# Altium project KS2E-PRECHG.PrjPcb
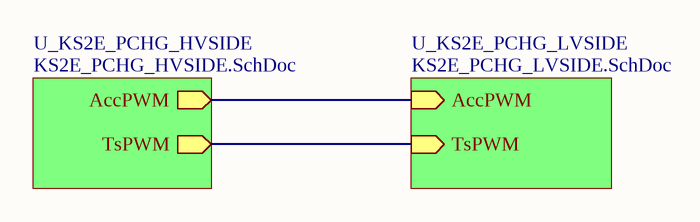
[diagram p0: KS2E_PRECHARGE.SchDoc]
3 sheets, 92 parts. Net scope: hierarchical (ports join the sheet entries above them; power ports are global).
Board file: KS2E_PRECHARGE.PcbDoc
Sheets:
  KS2E_PRECHARGE.SchDoc
    U_KS2E_PCHG_HVSIDE = KS2E_PCHG_HVSIDE.SchDoc
    U_KS2E_PCHG_LVSIDE = KS2E_PCHG_LVSIDE.SchDoc

## Sheet KS2E_PRECHARGE.SchDoc
size A; SheetNumber: 1; SheetTotal: 3

### Sub-sheets
U_KS2E_PCHG_HVSIDE = KS2E_PCHG_HVSIDE.SchDoc: TsPWM (out), AccPWM (out)
U_KS2E_PCHG_LVSIDE = KS2E_PCHG_LVSIDE.SchDoc: AccPWM (in), TsPWM (in)

### Nets
AccPWM: sheet U_KS2E_PCHG_HVSIDE/AccPWM, sheet U_KS2E_PCHG_LVSIDE/AccPWM
TsPWM: sheet U_KS2E_PCHG_HVSIDE/TsPWM, sheet U_KS2E_PCHG_LVSIDE/TsPWM

## Sheet KS2E_PCHG_HVSIDE.SchDoc
size A; SheetNumber: 3; SheetTotal: 3
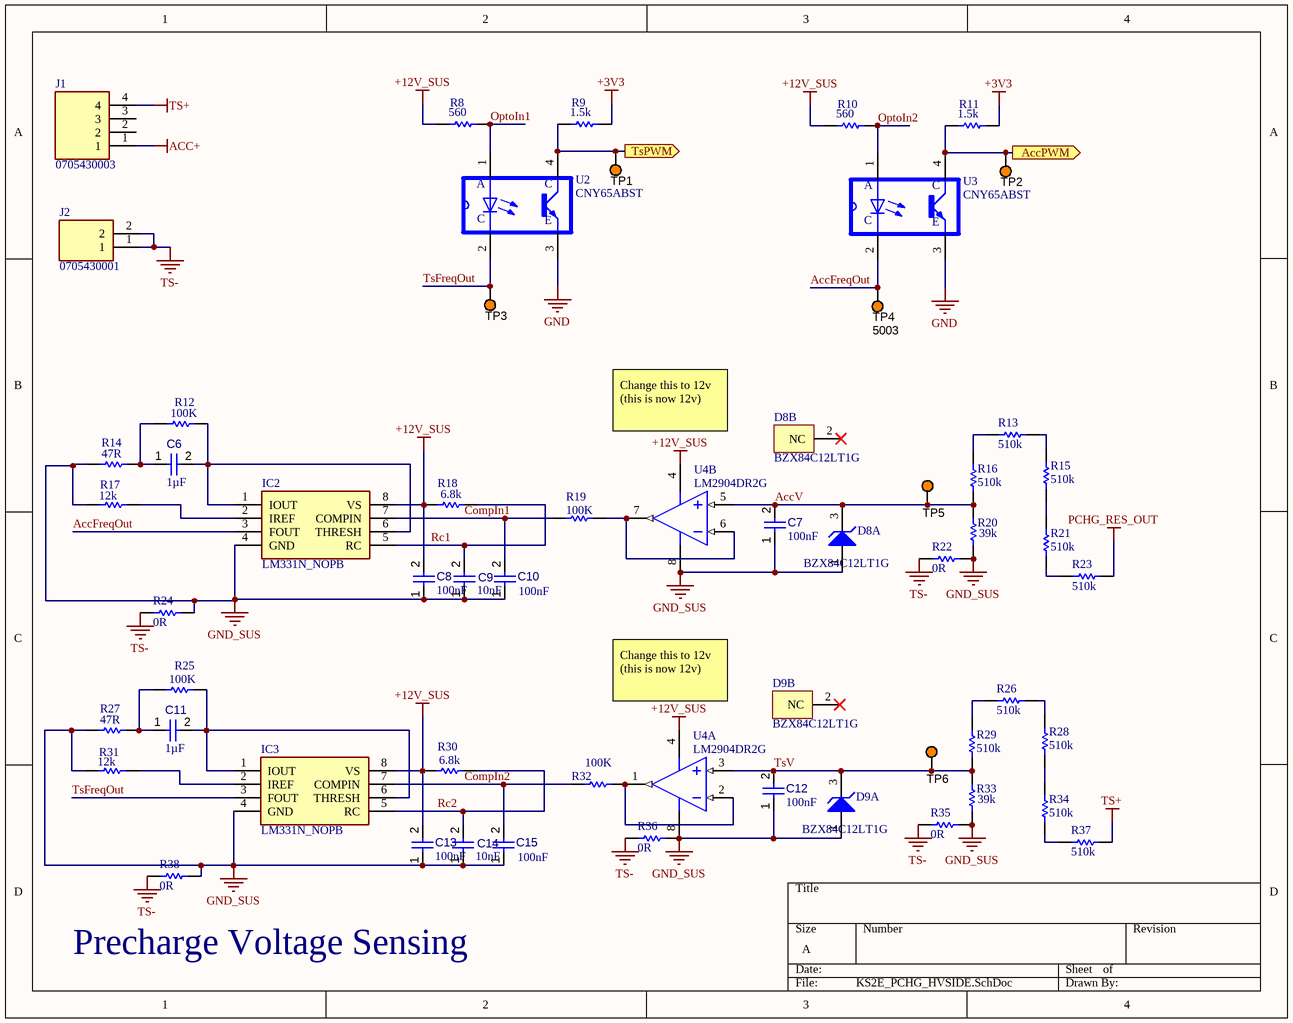
[diagram p1: KS2E_PCHG_HVSIDE.SchDoc]

### Parts
C6  value 1µF  [CAPC0603(1608)100_L]  (hidden comment: Capacitor 1µF +/-0.1% 25V 0603)
C7  value 100nF  [CAPC1608X90X40NL10T20]  (hidden comment: Capacitor 100 nF +/-10% 50 V 0603)
C8  value 100nF  [CAPC1608X90X40NL10T20]  (hidden comment: Capacitor 100 nF +/-10% 50 V 0603)
C9  value 10nF  [CAPC1608X90X40NL10T20]  (hidden comment: Capacitor 100 nF +/-10% 50 V 0603)
C10  value 100nF  [CAPC1608X90X40NL10T20]  (hidden comment: Capacitor 100 nF +/-10% 50 V 0603)
C11  value 1µF  [CAPC0603(1608)100_L]  (hidden comment: Capacitor 1µF +/-0.1% 25V 0603)
C12  value 100nF  [CAPC1608X90X40NL10T20]  (hidden comment: Capacitor 100 nF +/-10% 50 V 0603)
C13  value 100nF  [CAPC1608X90X40NL10T20]  (hidden comment: Capacitor 100 nF +/-10% 50 V 0603)
C14  value 10nF  [CAPC1608X90X40NL10T20]  (hidden comment: Capacitor 100 nF +/-10% 50 V 0603)
C15  value 100nF  [CAPC1608X90X40NL10T20]  (hidden comment: Capacitor 100 nF +/-10% 50 V 0603)
D8  BZX84C12LT1G  [ONSC-SOT-23-3-318-08_V]  (parts A,B of 2)
D9  BZX84C12LT1G  [ONSC-SOT-23-3-318-08_V]  (parts A,B of 2)
IC2  LM331N_NOPB  [DIP794W53P254L959H508Q8N]
IC3  LM331N_NOPB  [DIP794W53P254L959H508Q8N]
J1  0705430003  [SHDR4W64P0X254_1X4_1271X660X1181P]
J2  0705430001  [SHDR2W64P0X254_1X2_737X660X1181P]
R8  Resistance: 560  [RESC1609X55X30LL15T15]  (hidden comment: ERJ3EKF1002V)
R9  Resistance: 1.5k  [RESC1609X55X30LL15T15]  (hidden comment: ERJ3EKF1002V)
R10  Resistance: 560  [RESC1609X55X30LL15T15]  (hidden comment: ERJ3EKF1002V)
R11  Resistance: 1.5k  [RESC1609X55X30LL15T15]  (hidden comment: ERJ3EKF1002V)
R12  Resistance: 100K  [RESC1609X55X30LL15T15]  (hidden comment: ERJ3EKF1002V)
R13  510k  [RESC2013X60X40NL20T25]
R14  Resistance: 47R  [RESC1609X55X30LL15T15]  (hidden comment: ERJ3EKF1002V)
R15  510k  [RESC2013X60X40NL20T25]
R16  510k  [RESC2013X60X40NL20T25]
R17  Resistance: 12k  [RESC1609X55X30LL15T15]  (hidden comment: ERJ3EKF1002V)
R18  Resistance: 6.8k  [RESC1609X55X30LL15T15]  (hidden comment: ERJ3EKF1002V)
R19  Resistance: 100K  [RESC1609X55X30LL15T15]  (hidden comment: ERJ3EKF1002V)
R20  39k  [RESC2013X60X40LL20T25]
R21  510k  [RESC2013X60X40NL20T25]
R22  0R  [RESC2013X65X40LL15T20]
R23  510k  [RESC2013X60X40NL20T25]
R24  0R  [RESC2013X65X40LL15T20]
R25  Resistance: 100K  [RESC1609X55X30LL15T15]  (hidden comment: ERJ3EKF1002V)
R26  510k  [RESC2013X60X40NL20T25]
R27  Resistance: 47R  [RESC1609X55X30LL15T15]  (hidden comment: ERJ3EKF1002V)
R28  510k  [RESC2013X60X40NL20T25]
R29  510k  [RESC2013X60X40NL20T25]
R30  Resistance: 6.8k  [RESC1609X55X30LL15T15]  (hidden comment: ERJ3EKF1002V)
R31  Resistance: 12k  [RESC1609X55X30LL15T15]  (hidden comment: ERJ3EKF1002V)
R32  Resistance: 100K  [RESC1609X55X30LL15T15]  (hidden comment: ERJ3EKF1002V)
R33  value 39k  [RESC2013X60X40LL20T25]  (hidden comment: ERA6AEB393V)
R34  510k  [RESC2013X60X40NL20T25]
R35  0R  [RESC2013X65X40LL15T20]
R36  0R  [RESC2013X65X40LL15T20]
R37  510k  [RESC2013X60X40NL20T25]
R38  0R  [RESC2013X65X40LL15T20]
TP1  5003  [KSTN-5003]  (value not drawn)
TP2  5003  [KSTN-5003]  (value not drawn)
TP3  5003  [KSTN-5003]  (value not drawn)
TP4  5003  [KSTN-5003]
TP5  5003  [KSTN-5003]  (value not drawn)
TP6  5003  [KSTN-5003]  (value not drawn)
U2  CNY65ABST  [SOIC762P1940X755-4N]
U3  CNY65ABST  [SOIC762P1940X755-4N]
U4  LM2904DR2G  [ONSC-SOIC-8-751-07_V]  (parts A,B of 2)

### Ports
AccPWM (out), TsPWM (out)

### Nets
+3V3: R9.1 R11.1
+12V_SUS: C8.2 C13.2 IC2.8(VS) IC3.8(VS) R8.1 R10.1 R18.1 R30.1 U4.4(VEE/GND)
ACC+: J1.1
GND: U2.3(E) U3.3(E)
GND_SUS: C7.1 C8.1 C9.1 C10.1 C12.1 C13.1 C14.1 C15.1 D8.1(A) D9.1(A) IC2.4(GND) IC3.4(GND) R14.1 R17.1 R20.1 R22.1 R24.1 R27.1 R31.1 R33.1 R35.1 R36.1 R38.1 U4.8(VCC)
PCHG_RES_OUT: R23.2
TS+: J1.4 R37.2
TS-: J2.1 J2.2 R22.2 R24.2 R35.2 R36.2 R38.2
AccFreqOut: IC2.3(FOUT) TP4.1 U3.2(C)
AccPWM: R11.2 TP2.1 U3.4(C`) ; port AccPWM
AccV: C7.2 D8.3(K) R16.2 R20.2 TP5.1 U4.5(INB+)
CompIn1: C10.2 IC2.7(COMPIN) R19.1
CompIn2: C15.2 IC3.7(COMPIN) R32.1
OptoIn1: R8.2 U2.1(A)
OptoIn2: R10.2 U3.1(A)
Rc1: C9.2 IC2.5(RC) R18.2
Rc2: C14.2 IC3.5(RC) R30.2
TsFreqOut: IC3.3(FOUT) TP3.1 U2.2(C)
TsPWM: R9.2 TP1.1 U2.4(C`) ; port TsPWM
TsV: C12.2 D9.3(K) R29.2 R33.2 TP6.1 U4.3(INA+)
NetC6_1: C6.1 R12.1 R14.2
NetC6_2: C6.2 IC2.1(IOUT) IC2.6(THRESH) R12.2
NetC11_1: C11.1 R25.1 R27.2
NetC11_2: C11.2 IC3.1(IOUT) IC3.6(THRESH) R25.2
NetIC2_2: IC2.2(IREF) R17.2
NetIC3_2: IC3.2(IREF) R31.2
NetR13_1: R13.1 R15.2
NetR13_2: R13.2 R16.1
NetR15_1: R15.1 R21.1
NetR19_2: R19.2 U4.6(INB-) U4.7(OUTB)
NetR21_2: R21.2 R23.1
NetR26_1: R26.1 R28.2
NetR26_2: R26.2 R29.1
NetR28_1: R28.1 R34.1
NetR32_2: R32.2 U4.1(OUTA) U4.2(INA-)
NetR34_2: R34.2 R37.1

Not connected (* = marked no-connect by the designer): D8 2(NC)*; D9 2(NC)*; J1 2 3

### Notes on the sheet
- Change this to 12v
  (this is now 12v)
- Precharge Voltage Sensing

### Library data of the parts
C6 C11 = CMP-001-00055-4: Chip Capacitor, 1µF +/-0.1%, 25V, 0603, Thickness 1 mm; Tolerance: 20%; Min Operating Temperature: -55°C; Max Operating Temperature: 85°C; Voltage Rating: 25V; Mounting Technology: SMT; Case/Package: 0603; Pins: 2
C7-C10 C12-C15 = CMP-001-00017-6: Chip Capacitor, 100 nF, +/- 10%, 50 V, 0603 (1608 Metric); Voltage Rating: 50V; Capacitor Type: Ceramic; Tolerance: 10%; Mounting Technology: SM; Max Operating Temperature: 125°C; RoHS Compliant: True; Pins: 2; Case/Package: 0603; Min Operating Temperature: -55°C
D8 D9 = CMP-1060-00857-1: Zener Voltage Regulator, 225 mW, 3-Pin SOT-23, Pb-Free, Tape and Reel; Manufacturer: On Semiconductor; PackageDescription: 3-Pin Small Outline Transistor, Body 2.92 x 1.3 mm, Pitch 0.95 mm; ComponentLink1URL: http://www.onsemi.com/; ComponentLink3URL: http://www.onsemi.cn/pub_link/Collateral/318-08.PDF; Mounting Technology: Surface Mount; PartNumber: BZX84C12LT1G; ComponentLink3Description: Package Specification; RoHS: Pb-Free; DatasheetVersion: Rev. 17; ComponentLink2URL: http://www.onsemi.com/pub_link/Collateral/BZX84C2V4LT1-D.PDF; ComponentLink2Description: Datasheet; ComponentLink1Description: Manufacturer URL; Packing: Tape and Reel; PackageReference: SOT-23-3-318-08; PackageVersion: Rev. AP, 11/2009
IC2 IC3 = LM331N_NOPB: Integrated Circuit; Manufacturer_Name: Texas Instruments; Manufacturer_Part_Number: LM331N/NOPB; Datasheet Link: http://www.ti.com/lit/ds/symlink/lm231.pdf; Height: 5.08mm; Mouser Part Number: 926-LM331N/NOPB; Mouser Price/Stock: https://www.mouser.co.uk/ProductDetail/Texas-Instruments/LM331N-NOPB?qs=X1J7HmVL2ZHJklHIKp8KMQ%3D%3D; Arrow Part Number: LM331N/NOPB; Arrow Price/Stock: https://www.arrow.com/en/products/lm331nnopb/texas-instruments?region=nac
J1 = 0705430003: Connector; Manufacturer_Name: Molex; Datasheet Link: https://www.molex.com/pdm_docs/sd/705430001_sd.pdf; Height: 11.81mm; Manufacturer_Part_Number: 0705430003; Mouser Part Number: N/A; Mouser Price/Stock: https://www.mouser.co.uk/ProductDetail/Molex/0705430003?qs=PBcRNPEHKsrDKEIJAwSKnQ%3D%3D; Arrow Part Number: 0705430003; Arrow Price/Stock: https://www.arrow.com/en/products/0705430003/molex
J2 = 0705430001: Connector; Manufacturer_Name: Molex; Datasheet Link: https://www.molex.com/webdocs/datasheets/pdf/en-us/0705430001_PCB_HEADERS.pdf; Height: 11.81mm; Manufacturer_Part_Number: 0705430001; Mouser Part Number: N/A; Mouser Price/Stock: https://www.mouser.co.uk/ProductDetail/Molex/0705430001?qs=PBcRNPEHKsrZYrVlaLTOSA%3D%3D; Arrow Part Number: 0705430001; Arrow Price/Stock: https://www.arrow.com/en/products/0705430001/molex?region=europe
R8-R12 R14 R17-R19 R25 R27 R30-R32 = CMP-1012-00623-3: Chip Resistor, 10 KOhm, +/- 1%, 0.1 W, -55 to 155 degC, 0603 (1608 Metric), RoHS, Tape and Reel; Manufacturer: Panasonic; Voltage Rating: 75V; Case\/Package: 0603; Power Rating: 100mW; Temperature Coefficient: 100ppm\/degreesC; Number of Pins: 2; Package Reference: 603; Depth: 0.8mm; Mount: SurfaceMount; Package Description: 2-Pin Surface Mount Device, Body 1.6 x 0.85 mm; Datasheet Version: 02/2017; Length: 1.6mm; Lead Free: LeadFree; Height: 0.45mm; Number of Terminations: 2; Max Power Dissipation: 100mW; Min Operating Temperature: -55degC; Datasheet URL: https://industrial.panasonic.com/cdbs/www-data/pdf/RDA0000/AOA0000C304.pdf; Termination: SMD/SMT; Case Code (Metric): 1608; Case Code (Imperial): 0603; Tolerance: 1%; Max Operating Temperature: 155degC; RoHSCompliant: true; Voltage Rating (DC): 75V; Radiation Hardening: No; Packaging: TapeandReel; Composition: ThickFilm; Mounting Technology: SurfaceMount; Manufacturer URL: http://www.panasonic.com/; Width: 0.031inch; REACH SVHC: NoSVHC; Contact Plating: Tin; Military Standard: Not; Package Quantity: 1
R13 R15 R16 R21 R23 R26 R28 R29 R34 R37 = CMP-2001-00651-1: Part Number: ERA-6AEB514V; Manufacturer: Panasonic
R20 = CMP-2001-00636-1: Manufacturer: Panasonic; Part Number: ERA6AEB393V; Value: 39k
R22 R24 R35 R36 R38 = CMP-2000-07514-1: Chip Resistor, 0 Ohm, 0.125 W, -55 to 125 degC, 0805 (2012 Metric), RoHS, Tape and Reel; Manufacturer: TE Connectivity; Power Rating: 125mW; Voltage Rating: 150V; Tolerance: 0%; Case\/Package: 0805; Number of Resistors: 1; Resistance: 0mOhm; Datasheet URL: www.te.com/commerce/DocumentDelivery/DDEController?Action=showdoc&DocId=Customer+Drawing%7F1623401%7FBA%7Fpdf%7FEnglish%7FENG_CD_1623401_BA.pdf%7F1623401-1; Composition: ThickFilm; Max Operating Temperature: 125degC; Min Operating Temperature: -55degC; ELV: Compliant; Case Code (Metric): 2012; Number of Terminations: 2; Weight: 0.000194oz; Length: 2mm; Mount: SurfaceMount; Packaging: TapeandReel; Case Code (Imperial): 0805; RoHSCompliant: true; Width: 1.25mm; Radiation Hardening: No; Termination: Solder; Manufacturer URL: http://www.te.com/; Package Description: 2-Pin Surface Mount Device, Body 2 x 1.25 mm; Mounting Technology: SurfaceMount; Height: 0.55mm; Package Quantity: 5000; Package Reference: RESC2013X65X40L15T20; Datasheet Version: Rev. BA, 12/2009; Depth: 1.25mm
R33 = CMP-2001-00636-1: Manufacturer: Panasonic; Part Number: ERA6AEB393V
TP1-TP6 = CMP-002-00037-2: Test Point, Orange, Height 4.6 mm, Tail Length 3 mm, 1-Pin THD, RoHS; Manufacturer: Keystone; Colour: Orange; Packaging: Bulk; Package Description: 1-Pin Through Hole Device, Dia 2.54 mm; Pins: 1; Package Reference: 5003; Datasheet Version: Jun-15; Case/Package: 5003; Mounting Technology: TH; Connector Type: TestPoint; Diameter: 2.54mm; Contact Material: Bronze; Datasheet URL: http://keyelco.com/userAssets/file/M65p56.pdf; Manufacturer URL: http://www.keyelco.com/; Package Quantity: 10; Contact Plating: Tin; RoHS Compliant: True
U2 U3 = CNY65ABST: Semiconductor, Optocoupler; 600 mil High Voltage Isolation Dist; CTR, 80-240%; SMD-4; MF: Vishay Semiconductor; Value: *; MP: CNY65ABST; SnapEDA_Link: https://www.snapeda.com/parts/CNY65ABST/Vishay%20Semiconductor%20Opto%20Division/view-part/461465/?ref=snap; Availability: Unavailable; Package: SMD-4 Vishay; Price: None
U4 = CMP-1310-00321-1: Single Supply Dual Operational Amplifier, 3 to 32 V, -40 to 105 degC, 8-Pin SOIC, Pb-Free, Tape and Reel; Manufacturer: On Semiconductor; VCC Min (V): 3; VCC Max (V): 32; PackageDescription: 8-Pin Small Outline Integrated Circuit, Body 4.9 x 3.9 mm, Pitch 1.27 mm; RoHS: TRUE; ComponentLink1URL: http://www.onsemi.com/; Mounting Technology: Surface Mount; PackageReference: SOIC-8-751-07; Packing: Tape and Reel; DatasheetVersion: Rev. 27; PartNumber: LM2904DR2G; PackageVersion: Rev. AK, 02/2011; ComponentLink1Description: Manufacturer URL; ComponentLink3URL: http://www.onsemi.com/pub_link/Collateral/751-07.PDF; ComponentLink2Description: Datasheet; ComponentLink3Description: Package Specification; ComponentLink2URL: http://www.onsemi.cn/pub_link/Collateral/LM358-D.PDF

## Sheet KS2E_PCHG_LVSIDE.SchDoc
size A; SheetNumber: 2; SheetTotal: 3
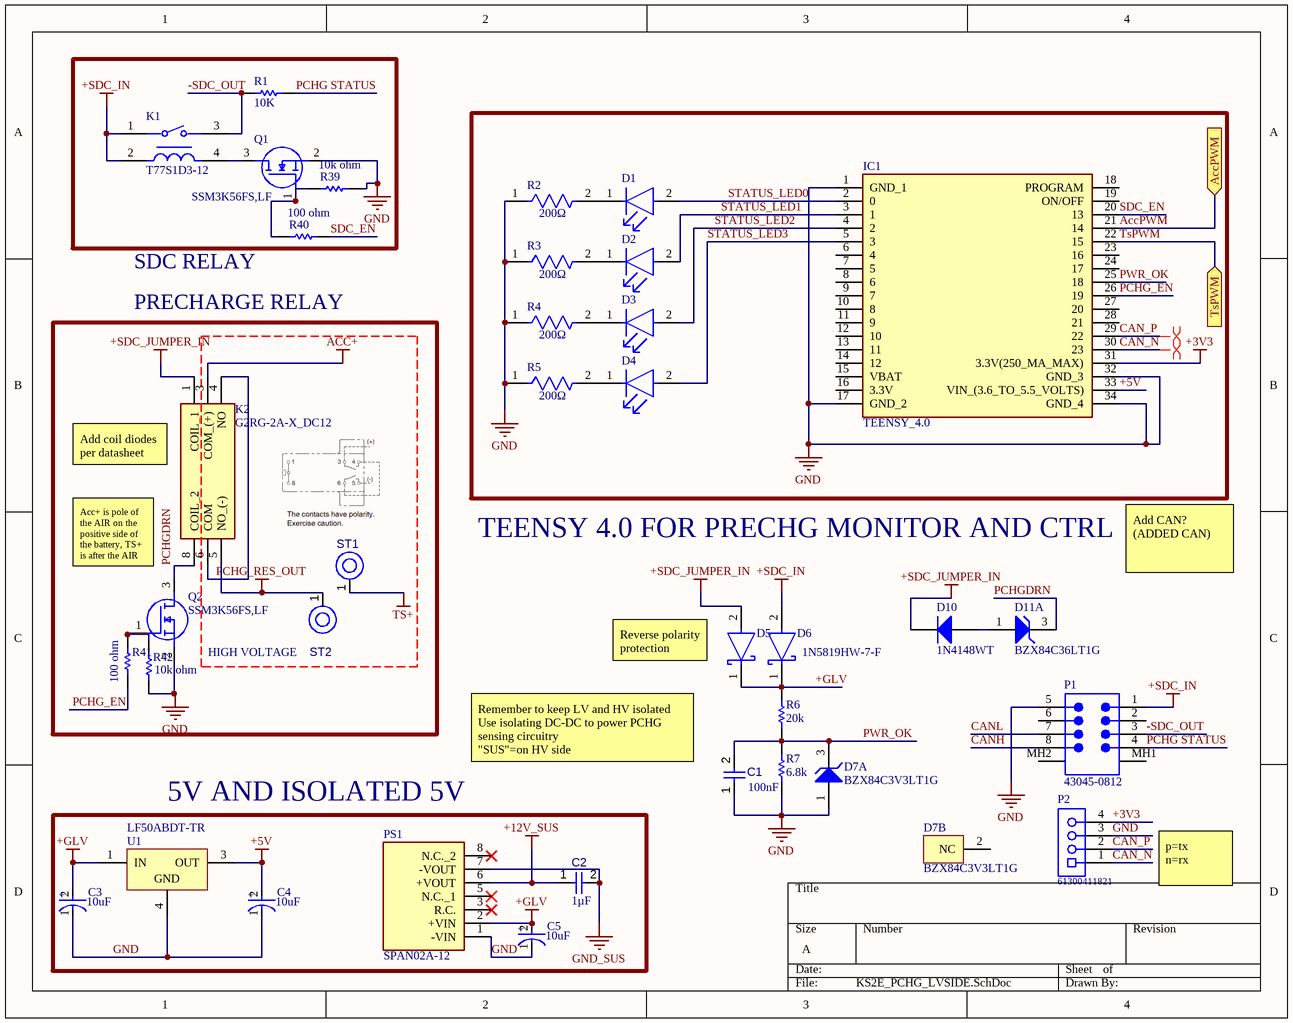
[diagram p2: KS2E_PCHG_LVSIDE.SchDoc]

### Parts
C1  value 100nF  [CAPC1608X90X40NL10T20]  (hidden comment: Capacitor 100 nF +/-10% 50 V 0603)
C2  value 1µF  [CAPC0603(1608)100_L]  (hidden comment: Capacitor 1µF +/-0.1% 25V 0603)
C3  Capacitance: 10uF  [FP-FKB-MFG]  (hidden comment: EEEFK1E100R)
C4  Capacitance: 10uF  [FP-FKB-MFG]  (hidden comment: EEEFK1E100R)
C5  Capacitance: 10uF  [FP-FKB-MFG]  (hidden comment: EEEFK1E100R)
D1  LTST-C193KGKT-5A  [FP-LTST-C193KGKT-5A-MFG]  (value not drawn)
D2  LTST-C193KRKT-5A  [FP-LTST-C193KRKT-5A-MFG]  (value not drawn)
D3  LTST-C193KGKT-5A  [FP-LTST-C193KGKT-5A-MFG]  (value not drawn)
D4  LTST-C193KRKT-5A  [FP-LTST-C193KRKT-5A-MFG]  (value not drawn)
D5  1N5819HW-7-F  [FP-SOD123-IPC_A]
D6  1N5819HW-7-F  [FP-SOD123-IPC_A]  (value not drawn)
D7  BZX84C3V3LT1G  [ONSC-SOT-23-3-318-08_V]  (parts A,B of 2)
D10  1N4148WT  [FAIR-SOD-523F-2_V]
D11  BZX84C36LT1G  [ONSC-SOT-23-3-318-08_V]  (part A of 2)
IC1  TEENSY_4.0  [TEENSY40]
K1  T77S1D3-12  [FP-T77S1D3-12-MFG]
K2  G2RG-2A-X_DC12  [G2RG2AXDC12]
P1  43045-0812  [MOLX-43045-0812_V]
P2  61300411821  [61300411821]
PS1  SPAN02A-12  [SPAN02A12]
Q1  SSM3K56FS,LF  [1SS423]
Q2  SSM3K56FS,LF  [1SS423]
R1  10K  [RESC1608X55X30ML15T15]
R2  Resistance: 200Ω  [FP-RN732A-MFG]  (hidden comment: RN73C2A200RBTD)
R3  Resistance: 200Ω  [FP-RN732A-MFG]  (hidden comment: RN73C2A200RBTD)
R4  Resistance: 200Ω  [FP-RN732A-MFG]  (hidden comment: RN73C2A200RBTD)
R5  Resistance: 200Ω  [FP-RN732A-MFG]  (hidden comment: RN73C2A200RBTD)
R6  20k  [RESC1608X55X30ML15T15]
R7  6.8k  [RESC1608X55X30ML15T15]
R39  10k ohm  [RESC1608X55X30LL15T15]
R40  100 ohm  [RESC1608X55X30LL15T15]
R41  100 ohm  [RESC1608X55X30LL15T15]
R42  10k ohm  [RESC1608X55X30LL15T15]
ST1  PTH-M2D5X5  [PTH-M2D5X5]  (value not drawn)
ST2  PTH-M2D5X5  [PTH-M2D5X5]  (value not drawn)
U1  LF50ABDT-TR  [TO-252_M]

### Blocks framed on the sheet
PRECHARGE RELAY: K2 Q2 R41 R42 ST1 ST2
5V AND ISOLATED 5V: C2-C5 PS1 U1

### Ports
AccPWM (in), TsPWM (in)

### Nets
+3V3: IC1.31(3.3V(250_MA_MAX)) P2.4
+5V: C4.2(A) IC1.33(VIN_(3.6_TO_5.5_VOLTS)) U1.3(OUT)
+12V_SUS: C2.1 PS1.6(+VOUT)
+GLV: C3.2(A) C5.2(A) D5.1(C) D6.1(C) PS1.2(+VIN) R6.2 U1.1(IN)
+SDC_IN: D6.2(A) K1.1 K1.2 P1.1
+SDC_JUMPER_IN: D5.2(A) D10.1(K) K2.1(COIL_1)
ACC+: K2.3(COM_(+))
GND: C1.1 C3.1(C) C4.1(C) C5.1(C) D7.1(A) IC1.1(GND_1) IC1.17(GND_2) IC1.32(GND_3) IC1.34(GND_4) P1.5 P2.3 PS1.1(-VIN) Q1.2(S) Q2.2(S) R2.1 R3.1 R4.1 R5.1 R7.1 R39.2 R42.2 U1.4(GND)
GND_SUS: C2.2 PS1.7(-VOUT)
PCHG_RES_OUT: K2.5(NO_(-)) ST2.1(H1)
TS+: ST1.1(H1)
-SDC_OUT: K1.3 P1.3 R1.2
AccPWM: IC1.21(14) ; port AccPWM
CAN_N: IC1.30(23) P2.1
CAN_P: IC1.29(22) P2.2
CANH: P1.8
CANL: P1.7
PCHG STATUS: P1.4 R1.1
PCHG_EN: IC1.26(19) R41.1
PCHGDRN: D11.3(K) K2.8(COIL_2) Q2.3(D)
PWR_OK: C1.2 D7.3(K) IC1.25(18) R6.1 R7.2
SDC_EN: IC1.20(13) R40.2
STATUS_LED0: D1.2(A) IC1.2(0)
STATUS_LED1: D2.2(A) IC1.3(1)
STATUS_LED2: D3.2(A) IC1.4(2)
STATUS_LED3: D4.2(A) IC1.5(3)
TsPWM: IC1.22(15) ; port TsPWM
NetD1_1: D1.1(C) R2.2
NetD2_1: D2.1(C) R3.2
NetD3_1: D3.1(C) R4.2
NetD4_1: D4.1(C) R5.2
NetD10_2: D10.2(A) D11.1(A)
NetK1_4: K1.4 Q1.3(D)
NetK2_4: K2.4(NO) K2.6(COM)
NetQ1_1: Q1.1(G) R39.1 R40.1
NetQ2_1: Q2.1(G) R41.2 R42.1

Not connected (* = marked no-connect by the designer): D7 2(NC); IC1 6(4) 7(5) 8(6) 9(7) 10(8) 11(9) 12(10) 13(11) 14(12) 15(VBAT) 16(3.3V) 18(PROGRAM) 19(ON/OFF) 23(16) 24(17) 27(20) 28(21); P1 2 6 MH1 MH2; PS1 3(R.C.)* 5(N.C._1)* 8(N.C._2)*

### Layout directives
differential pair: CAN_N, CAN_P

### Notes on the sheet
- SDC RELAY
- (near K2) Add coil diodes
  per datasheet
- Acc+ is pole of the AIR on the positive side of the battery, TS+ is after the AIR
- TEENSY 4.0 FOR PRECHG MONITOR AND CTRL
- Add CAN?
  (ADDED CAN)
- (near Q2) HIGH VOLTAGE
- (near D5) Reverse polarity protection
- Remember to keep LV and HV isolated
  Use isolating DC-DC to power PCHG sensing circuitry
  "SUS"=on HV side
- p=tx
  n=rx
- (in symbol CMP-05427-000055-1) +

### Library data of the parts
C1 = CMP-001-00017-6: as C7 on sheet KS2E_PCHG_HVSIDE; Tolerance: 10%; Mounting Technology: SM; Max Operating Temperature: 125°C; RoHS Compliant: True; Pins: 2; Case/Package: 0603; Min Operating Temperature: -55°C
C2 = CMP-001-00055-4: as C6 on sheet KS2E_PCHG_HVSIDE; Min Operating Temperature: -55°C; Max Operating Temperature: 85°C; Voltage Rating: 25V; Mounting Technology: SMT; Case/Package: 0603; Pins: 2
C3-C5 = CMP-05427-000055-1: CAP ALUM 10UF 20% 25V SMD; ESR (Equivalent Series Resistance): 1.35R; Life (Hours): 2000Hour; Dielectric Material: Aluminium; Leakage Current: 3uA; Ripple Current (AC): 90mA; Polarity: Polar; Voltage: 25V; Voltage Rating: 25V; Number of Pins: 2; Package Quantity: 1; Max Operating Temperature: 105°C; Tolerance: 20%; Voltage Rating (DC): 25V; Packaging: Tape and Reel; Impedance: 1.35R; Case/Package: Radial; Series: FK; Height - Seated (Max): 0.24inch; Diameter: 4mm; Length: 5.8mm; Construction: Cylindrical; Height: 5.8mm; Mount: Surface Mount; REACH SVHC: No SVHC; Termination: SMD/SMT; Lead Free: Lead Free; RoHS Compliant: Yes; Contact Plating: Tin; Width: 5.5mm; Radiation Hardening: No; Min Operating Temperature: -55°C; Ripple Current: 90mA
D1 D3 = CMP-2000-06622-2: LED GREEN CLEAR CHIP SMD; Forward Current: 30mA; Power Dissipation: 75mW; Luminous Intensity: 28mcd; Lens Style: Diffused; Lens Color: Colorless; Forward Voltage: 2.3V; Test Current: 5mA; Viewing Angle: 130°; Reverse Voltage: 5V; Dominant Wavelength: 576.5nm; Number of Elements: 1; Number of Pins: 2; Case/Package: 0603; Width: 0.8mm; Radiation Hardening: No; Lead Free: Lead Free; Lens Transparency: Clear; Max Operating Temperature: 85°C; Illumination Color: Green; Color: Green; Packaging: Tape and Reel; Depth: 0.8mm; Length: 1.6mm; Mount: Surface Mount; Case Code (Imperial): 0603; Height: 0.35mm; Min Operating Temperature: -55°C; Package Quantity: 3000; Case Code (Metric): 1608; Power Rating: 75mW; Number of LEDs: 1
D2 D4 = CMP-2000-06623-2: LED RED CLEAR CHIP SMD; Power Dissipation: 50mW; Lens Style: Diffused; Test Current: 5mA; Dominant Wavelength: 631nm; Reverse Voltage: 5V; Number of Elements: 1; Viewing Angle: 130°; Luminous Intensity: 45mcd; Lens Color: Colorless; Forward Voltage: 2.3V; Case Code (Imperial): 0603; Illumination Color: Red; Lead Free: Lead Free; Radiation Hardening: No; Width: 0.8mm; Number of Pins: 2; Packaging: Tape and Reel; Depth: 0.8mm; Height: 0.35mm; Mount: Surface Mount; Case Code (Metric): 1608; Forward Current: 5mA; Lens Transparency: Clear; Case/Package: 0603; Length: 1.6mm; Color: Red; Max Operating Temperature: 85°C; Number of LEDs: 1; Min Operating Temperature: -55°C; Package Quantity: 3000
D5 D6 = CMP-0303-00003-3: DIODE SCHOTTKY 40V 1A SOD123; Forward Voltage: 450mV; Capacitance: 110pF; Max Forward Surge Current (Ifsm): 25A; Peak Reverse Current: 50uA; Polarity: Standard; Element Configuration: Single; Max Power Dissipation: 450mW; Min Operating Temperature: -65°C; Package Quantity: 3000; Contact Plating: Tin; Weight: 0.000353oz; Max Repetitive Reverse Voltage (Vrrm): 40V; Max Reverse Voltage (DC): 40V; Height: 1.25mm; Average Rectified Current: 1A; Width: 1.7mm; Case/Package: SOD-123-2; Lead Free: Lead Free; Max Operating Temperature: 125°C; Current Rating: 1A; Termination: SMD/SMT; Forward Current: 1A; Radiation Hardening: No; Number of Pins: 2; Length: 2.85mm; Voltage Rating (DC): 40V; REACH SVHC: No SVHC; Peak Non-Repetitive Surge Current: 25A; Packaging: Tape and Reel; Output Current: 1A
D7 = CMP-1060-01189-1: Zener Voltage Regulator, 225 mW, 3-Pin SOT-23, Pb-Free, Tape and Reel; Manufacturer: On Semiconductor; ComponentLink2Description: Datasheet; ComponentLink3Description: Package Specification; PackageVersion: Rev. AP, 11/2009; ComponentLink3URL: http://www.onsemi.cn/pub_link/Collateral/318-08.PDF; Mounting Technology: Surface Mount; DatasheetVersion: Rev. 17; ComponentLink2URL: http://www.onsemi.com/pub_link/Collateral/BZX84C2V4LT1-D.PDF; PackageDescription: 3-Pin Small Outline Transistor, Body 2.92 x 1.3 mm, Pitch 0.95 mm; RoHS: Pb-Free; ComponentLink1URL: http://www.onsemi.com/; ComponentLink1Description: Manufacturer URL; PartNumber: BZX84C3V3LT1G; PackageReference: SOT-23-3-318-08; Packing: Tape and Reel
D10 = CMP-0881-00001-1: High Conductance Fast Switching Diode, 75 V, -55 to 150 degC, 2-Pin SOD523F, RoHS; Manufacturer: Fairchild Semiconductor; IR (VR: 75 V)=5 uA Max.; VF: 1 V Max.; BVR (IR: 5 uA)=75 V Min.; CO: 4 pF Max.; DatasheetVersion: Rev. A2; ComponentLink1Description: Manufacturer URL; PackageDescription: 2-Pin Surface Mount Device, Body 1.2 x 0.8 mm, Height 0.7 mm; ComponentLink2URL: http://www.fairchildsemi.com/ds/1N/1N4148WT.pdf; ComponentLink2Description: Datasheet; PartNumber: 1N4148WT; ComponentLink1URL: http://www.fairchildsemi.com/; Temperature Range: -55 to 150 degC; Mounting Technology: Surface Mount; PackageReference: SOD-523F-2; RoHS: TRUE
D11 = CMP-1060-01178-1: Zener Voltage Regulator, 225 mW, 3-Pin SOT-23, Pb-Free, Tape and Reel; Manufacturer: On Semiconductor; Packing: Tape and Reel; ComponentLink1Description: Manufacturer URL; Mounting Technology: Surface Mount; ComponentLink3URL: http://www.onsemi.cn/pub_link/Collateral/318-08.PDF; ComponentLink2Description: Datasheet; RoHS: Pb-Free; PartNumber: BZX84C36LT1G; ComponentLink1URL: http://www.onsemi.com/; PackageReference: SOT-23-3-318-08; DatasheetVersion: Rev. 17; PackageDescription: 3-Pin Small Outline Transistor, Body 2.92 x 1.3 mm, Pitch 0.95 mm; ComponentLink2URL: http://www.onsemi.com/pub_link/Collateral/BZX84C2V4LT1-D.PDF; PackageVersion: Rev. AP, 11/2009; ComponentLink3Description: Package Specification
IC1 = TEENSY_4.0: Integrated Circuit; Manufacturer_Name: Teensy; Manufacturer_Part_Number: TEENSY 4.0; Datasheet Link: https://www.pjrc.com/store/teensy40.html; Height: 4.64mm
K1 = CMP-03396-000213-1: RELAY GEN PURPOSE SPST 3A 12V; Coil Power: 200mW; Contact Voltage Rating (DC): 30V; Coil Type: Non-Latching; Voltage Rating (AC): 250V; Coil Current: 16.67mA; Relay Type: General Purpose; Approvals: UL; Coil Resistance: 720R; Release Time: 4ms; Operate Time: 10ms; RoHS Compliant: Yes; Radiation Hardening: No; Height: 14.7mm; Min Operating Temperature: -30°C; Weight: 9g; Contact Current Rating: 3A; Coil Voltage (DC): 12V; Termination: PCB; Series: T77; Depth: 10.2mm; Mount: Through Hole; Current Rating: 3A; Power Consumption: 200mW; Max Voltage Rating (DC): 30V; Number of Pins: 4; Lead Free: Lead Free; Package Quantity: 100; Max Voltage Rating (AC): 250V; Application(s): GENERAL PURPOSE; Power Rating: 200mW; Length: 0.717inch; ELV: Compliant; Width: 0.4inch; Type: Electromechanical; Throw Configuration: SPST; Packaging: Tray; Max Operating Temperature: 105°C; Contact Material: Silver
K2 = G2RG-2A-X_DC12: Relay or Contactor; Manufacturer_Name: Omron Electronics; Manufacturer_Part_Number: G2RG-2A-X DC12; Datasheet Link: https://media.digikey.com/pdf/Data%20Sheets/Omron%20PDFs/G2RG-X.pdf; Height: 29.5mm; Mouser Part Number: 653-G2RG-2A-XDC12; Mouser Price/Stock: https://www.mouser.co.uk/ProductDetail/Omron-Electronics/G2RG-2A-X-DC12?qs=DPoM0jnrROVJ0ySZlbdwjA%3D%3D
P1 = CMP-1594-00003-1: 3 mm Pitch Micro-Fit 3.0 Connector, 17.27 mm Mated Height, Vertical, Through Hole, 8 Circuits, -40 to 105 degC, RoHS, Tray; Pitch: 3 mm; No. of Positions: 8; No. of Rows: 2; ComponentLink2Description: Datasheet; ComponentLink2URL: http://www.molex.com/webdocs/datasheets/pdf/en-us/0430450812_PCB_HEADERS.pdf; Orientation: Vertical; PartNumber: 43045-0812; Packing: Tray; Temperature Min: -40 degC; RoHS: TRUE; ComponentLink3Description: Package Specification; Temperature Max: 105 degC; ComponentLink3URL: http://www.molex.com/pdm_docs/sd/430450812_sd.pdf; Mounting Technology: Through Hole; PackageVersion: Rev. F, 06/2009; ComponentLink1Description: Manufacturer URL; PackageDescription: 8-Pin PCB Header, Vertical, Pitch 3 mm, Mated Height 17.27 mm, Through Hole; ComponentLink1URL: http://www.molex.com/
P2 = CMP-1502-01316-1: THT Vertical Socket Header WR-PHD, Pitch 2.54 mm, Single Row, 4 pins; Manufacturer: Wurth Elektronik; Working Voltage: 250VAC; Rated Current: 3A; Pin Number: 4; Withstanding Voltage: 500VAC; Contact Resistance: 20mOhm; Gender: Female; Pitch: 2.54mm; Datasheet URL: https://katalog.we-online.de/em/datasheet/6130xx11821.pdf; Part Number: 61300411821; Operating Temperature: -40to125degC; Row Number: Single; Package Reference: 61300411821; Orientation: Vertical; Publisher: WurthElektronik; Packaging: Tray; Manufacturer URL: http://www.we-online.de; Mounting Technology: THT
PS1 = SPAN02A-12: Power Supply; Manufacturer_Name: Mean Well; Datasheet Link: https://datasheet.datasheetarchive.com/originals/distributors/DKDS-2/37032.pdf; Height: 11.6mm; Manufacturer_Part_Number: SPAN02A-12; Mouser Part Number: 709-SPAN02A-12; Mouser Price/Stock: https://www.mouser.co.uk/ProductDetail/MEAN-WELL/SPAN02A-12?qs=5aG0NVq1C4wxQqKsG84AkQ%3D%3D; Arrow Part Number: SPAN02A-12; Arrow Price/Stock: https://www.arrow.com/en/products/span02a-12/mean-well-enterprises?region=nac
Q1 Q2 = SSM3K56FS,LF: MOSFET (N-Channel); Manufacturer_Name: Toshiba; Datasheet Link: http://toshiba.semicon-storage.com/info/docget.jsp?did=13419&prodName=SSM3K56FS; Height: 0mm; Manufacturer_Part_Number: SSM3K56FS,LF; Mouser Part Number: 757-SSM3K56FSLF; Mouser Price/Stock: https://www.mouser.co.uk/ProductDetail/Toshiba/SSM3K56FSLF?qs=PiFplXvYe5XjAd54EjZm0w%3D%3D; Arrow Part Number: SSM3K56FS,LF; Arrow Price/Stock: https://www.arrow.com/en/products/ssm3k56fslf/toshiba?region=nac
R1 R6 R7 = CMP-2000-00318-1: Part Number: ERJ-3EKF2002V; Manufacturer: Panasonic
R2-R5 = CMP-03211-010956-1: SMD Chip Resistor, Thin Film, 200Ω, 100 V, 0805 [2012 Metric], 100 mW, 0.1%, RN73 Series; Manufacturer: TE Connectivity; Temperature Coefficient: 10ppm/°C; Power Rating: 0.1W; Voltage Rating: 100V; Package: RN732A; Temperature Range Low: -55°C; Ipc Land Pattern Name: RESC200125X55; Device Class L1: Passive Components; packaging: 5000 Reel; Device Class L2: Resistors; Height: 0.65mm; Automotive: No; Series: RN73; Temperature: -55°C to 155°C; ComponentLink2Description: Datasheet; octopart_url: https://octopart.com/rn73c2a200rbtd-te+connectivity-22736993; RoHS: TRUE; Category: Res; Value: 200Ω; Temperature Range High: 155°C; Lead Free: Yes; Tolerance: 0.1%; ComponentLink2URL: https://www.te.com/commerce/DocumentDelivery/DDEController?Action=showdoc&DocId=Data+Sheet%7F1773270%7FP%7Fpdf%7FEnglish%7FENG_DS_1773270_P.pdf%7F1676162-2; Manufacturer Part Number: RN73C2A200RBTD; Device Class L3: Chip SMD Resistors; Octopart: https://octopart.com/rn73c2a200rbtd-te+connectivity-22736993; Composition: Thin Film
R39-R42 = CMP-2000-00335-2: Chip Resistor, 220 Ohm, +/- 1%, 0.1 W, -55 to 155 degC, 0603 (1608 Metric), RoHS, Tape and Reel; Voltage Rating: 50 V; Resistance: 22 Ohm; Power Rating: 100 mW; Case\Package: 0603; ComponentLink2Description: Datasheet; PackageDescription: 2-Pin Surface Mount Device, Body 1.6 x 0.85 mm; PackageReference: 0603; ComponentLink1Description: Manufacturer URL; ComponentLink2URL: http://industrial.panasonic.com/cdbs/www-data/pdf/RDA0000/AOA0000C86.pdf; Height: 0.45 mm; Mount: Surface Mount; Case Code (Metric): 1608; Pins: 2; Width: 0.8 mm; Length: 1.6 mm; Package Quantity: 5000; Tolerance: 1%; ComponentLink1URL: http://www.panasonic.com/; Max Operating Temperature: 155 degC; Min Operating Temperature: -55 degC; RoHSCompliant: true; Packaging: Tape and Reel; Case Code (Imperial): 0603; DatasheetVersion: Apr-15; REACH SVHC: No SVHC; Voltage Rating (DC): 50 V
ST1 ST2 = CMP-00028-00004-2: M2 PTH (2.5mm), 5mm pad; Pins: 1
U1 = CMP-0244-00070-1: 500mA, Very Low Drop (0.45V) Voltage Regulator, 5V, 3-Pin DPAK, Tape and Reel; DatasheetVersion: 1/11/2010; ComponentLink1URL: http://www.st.com; ComponentLink1Description: Manufacturer URL; ComponentLink2URL: http://www.st.com/internet/com/TECHNICAL_RESOURCES/TECHNICAL_LITERATURE/DATASHEET/CD00000546.pdf; PackageReference: TO-252; PackageDescription: 3-Pin Transistor Outline Package 2.28 mm Pitch, 9.7 mm Lead Span (DPAK); ComponentLink2Description: Datasheet; PackageVersion: 2011

## Nets that join several sheets
+3V3: KS2E_PCHG_HVSIDE (R9.1 R11.1), KS2E_PCHG_LVSIDE (IC1.31 P2.4)
+12V_SUS: KS2E_PCHG_HVSIDE (9 pins), KS2E_PCHG_LVSIDE (C2.1 PS1.6)
ACC+: KS2E_PCHG_HVSIDE (J1.1), KS2E_PCHG_LVSIDE (K2.3)
GND: KS2E_PCHG_HVSIDE (U2.3 U3.3), KS2E_PCHG_LVSIDE (22 pins)
GND_SUS: KS2E_PCHG_HVSIDE (24 pins), KS2E_PCHG_LVSIDE (C2.2 PS1.7)
PCHG_RES_OUT: KS2E_PCHG_HVSIDE (R23.2), KS2E_PCHG_LVSIDE (K2.5 ST2.1)
TS+: KS2E_PCHG_HVSIDE (J1.4 R37.2), KS2E_PCHG_LVSIDE (ST1.1)
AccPWM: KS2E_PCHG_HVSIDE (R11.2 TP2.1 U3.4), KS2E_PCHG_LVSIDE (IC1.21)
TsPWM: KS2E_PCHG_HVSIDE (R9.2 TP1.1 U2.4), KS2E_PCHG_LVSIDE (IC1.22)